# EAGLE design pwrModule (EAGLE 6.5.0)
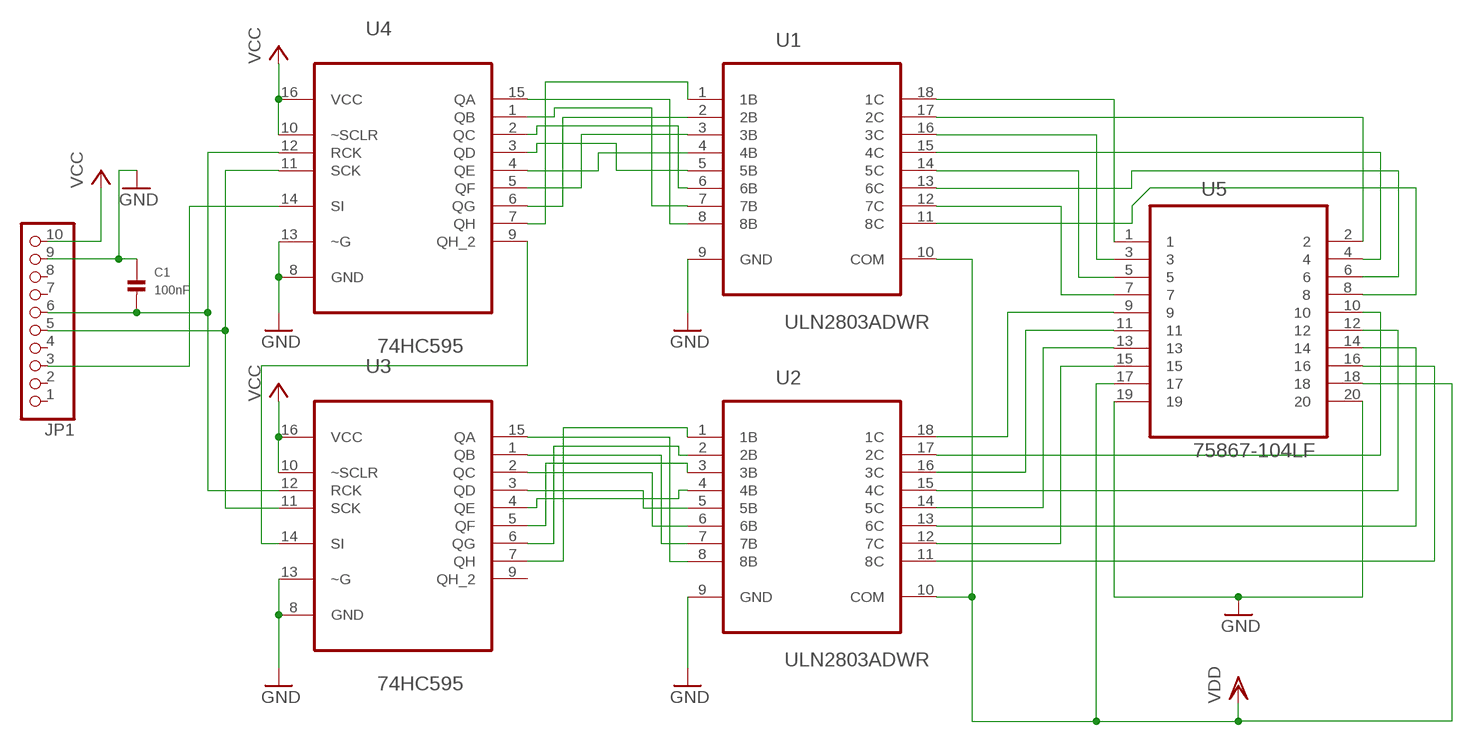
[diagram p0: schematic, sheet 1]

## Parts
C1  100nF  CAP_CERAMIC0805  [0805]
JP1  PINHD-1X10/90  [1X10/90]
U1  ULN2803ADWR  [SOIC127P1030X265-18N]
U2  ULN2803ADWR  [SOIC127P1030X265-18N]
U3  74HC595  M74HC595RM13TR  [SOIC127P600X175-16N]
U4  74HC595  M74HC595RM13TR  [SOIC127P600X175-16N]
U5  75867-104LF  [FCI_75867-104LF]

## Nets
GND: C1.1 JP1.9 U1.9(GND) U2.9(GND) U3.8(GND) U3.13(~G) U4.8(GND) U4.13(~G) U5.19 U5.20
N$1: C1.2 JP1.6 U3.12(RCK) U4.12(RCK)
N$2: JP1.5 U3.11(SCK) U4.11(SCK)
N$3: U3.14(SI) U4.9(QH_2)
N$4: U1.18(1C) U5.1
N$5: U2.8(8B) U3.15(QA)
N$6: U2.7(7B) U3.1(QB)
N$7: U2.6(6B) U3.2(QC)
N$8: U2.5(5B) U3.3(QD)
N$9: U2.4(4B) U3.4(QE)
N$10: U2.3(3B) U3.5(QF)
N$11: U2.2(2B) U3.6(QG)
N$12: U2.1(1B) U3.7(QH)
N$13: U1.1(1B) U4.7(QH)
N$14: U1.2(2B) U4.6(QG)
N$15: U1.3(3B) U4.5(QF)
N$16: U1.4(4B) U4.4(QE)
N$17: U1.5(5B) U4.3(QD)
N$18: U1.8(8B) U4.15(QA)
N$19: U1.7(7B) U4.1(QB)
N$20: U1.6(6B) U4.2(QC)
N$21: JP1.3 U4.14(SI)
N$22: U1.17(2C) U5.2
N$23: U1.16(3C) U5.3
N$24: U1.15(4C) U5.4
N$25: U1.14(5C) U5.5
N$26: U1.13(6C) U5.6
N$27: U1.12(7C) U5.7
N$28: U1.11(8C) U5.8
N$29: U2.18(1C) U5.9
N$30: U2.17(2C) U5.10
N$31: U2.16(3C) U5.11
N$32: U2.15(4C) U5.12
N$33: U2.14(5C) U5.13
N$34: U2.13(6C) U5.14
N$35: U2.12(7C) U5.15
N$36: U2.11(8C) U5.16
VCC: JP1.10 U3.10(~SCLR) U3.16(VCC) U4.10(~SCLR) U4.16(VCC)
VDD: U1.10(COM) U2.10(COM) U5.17 U5.18
Unconnected: JP1.1 JP1.2 JP1.4 JP1.7 JP1.8 U3.9(QH_2)

## Library data of the parts
C1 = microbuilder:CAP_CERAMIC: Ceramic Capacitors 0402 - 0402 Surface Mount Capacitors 16pF 50V 5% [Digikey: 445-4899-2-ND] 18pF 50V 5% [Digikey: 490-1281-2-ND] 22pF 50V 5% [Digikey: 490-1283-2-ND] 68pF 50V 5% [Digikey: 490-1289-2-ND] 0.1uF 10V 10% [Digikey: 490-1318-2-ND] 1.0uF 6.3V 10% [Digikey: 490-1320-2-ND] 0603 - 0603 Surface Mount Capacitors 16 pF 50V 5% [Digikey: 445-5051-2-ND] 22 pF 50V [Digikey: PCC220ACVTR-ND] 33 pF 50V 5% [Digikey: 490-1415-1-ND] 56pF 50V 5% [Digikey: 490-1421-1-ND] 220pF 50V 5% [Digikey: 445-1285-1-ND] 680 pF 50V 2200 pF 50V 5% C0G [Digikey: 445-1297-1-ND] 5600 pF 100V 5% X7R [Digikey: 478-3711-1-ND] 0.1 µF 25V 10% [Digikey: PCC2277TR-ND] 0.22 µF 16V 10% X7R [Digikey: 445-1318-1-ND] 1.0 µF 25V 10% [Digikey: 445-5146-2-ND] 0603 - RF Specific 3pF 250V +/-0.1pF RF [Digikey: 712-1347-1-ND] 18 pF 250V 5% [Digikey: 478-3505-1-ND or 712-1322-1-ND] 56 pF 250V 5% C0G RF [Digikey: 490-4867-1-ND] 68 pF 250V RF [Digikey: 490-4868-1-ND] 0805 - 0805 Surface Mount Capacitors 220 pF 250V 2% RF Ceramic Capacitor [Digikey: 712-1398-1-ND] 1000 pF 50V 2% NP0 Ceramic Capacitor [Digikey: 478-3760-1-ND] 0.1 µF 25V 10% Ceramic Capacitor [Digikey: PCC1828TR-ND] 1.0 µF 16V 10% Ceramic Capacitor[Digikey: 490-1691-2-ND] 10.0 µF 10V 10% Ceramic Capacitor[Digikey: 709-1228-1-ND] 10.0 uF 16V 10% Ceramic Capacitor [Digikey: 478-5165-2-ND] 47 uF 6.3V 20% Ceramic Capacitor [Digikey: 587-1779-1-ND or 399-5506-1-ND] 1206 - 1206 Surface Mount Capacitors 47uF 10V 20% Ceramic Capacitor [Digikey: 490-5528-1-ND or 399-5508-1-ND or 445-6010-1-ND] 100uF 6.3V -20%, +80% Y5V Ceramic Capacitor (Digikey: 490-4512-1-ND, Mouser: 81-GRM31CF50J107ZE1L)
JP1 = pinhead:PINHD-1X10: PIN HEADER
U1 U2 = uln2803:ULN2803ADWR: Darlington transistor array; MPN: ULN2803ADWR; OC_FARNELL: 1652420; OC_NEWARK: 87H4769; PACKAGE: SOIC-18; SUPPLIER: TEXAS INSTRUMENTS
U3 U4 = 74HC595:M74HC595RM13TR: 8 BIT SHIFT REGISTER WITH OUTPUT LATCHES (3 STATE); MPN: M74HC595RM13TR; OC_FARNELL: 1288450; OC_NEWARK: 89K0930; PACKAGE: SOIC-16; SUPPLIER: STMICROELECTRONICS
U5 = HE10-20:75867-104LF: HEADER, RIGHT ANGLE-20POS; MPN: 75867-104LF; OC_FARNELL: 1103958; OC_NEWARK: 93K5084; PACKAGE: CONN-20POS; SUPPLIER: FCI

## Board
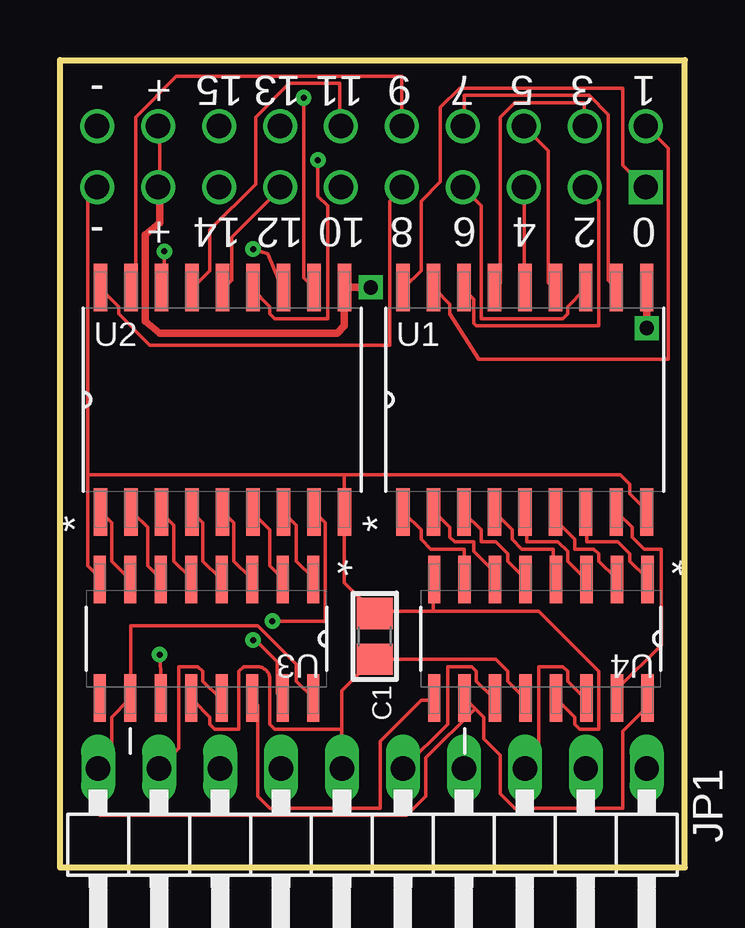
[diagram p1: board, top side]
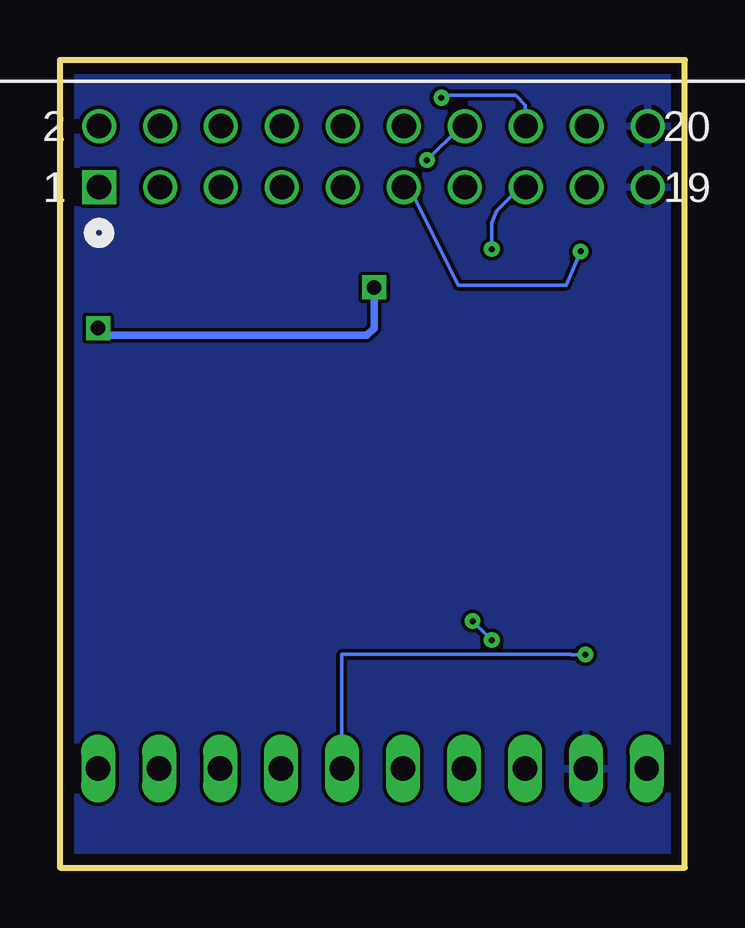
[diagram p2: board, bottom side, seen from below]

Size 26.04 x 33.66 mm. Coordinates in mm from the lower left corner, seen from the top.
Outline: 0,0 0,33.66 26.04,33.66 26.04,0 0,0
Copper layers (1*16): Top 0.018mm / dielectric 1.55mm / Bottom 0.018mm
Design rules "eC-STANDARD_pool-2-layer ": minimum track width 0.15mm, minimum drill 0.25mm, track to track 0.15mm, track to pad 0.15mm, pad to pad 0.15mm, via to via 0.15mm, smd to smd 0.15mm, copper to edge 0.45mm, drill to drill 0.3mm, minimum pad ring 0.2mm, minimum via ring 0.2mm, stop-mask expansion 0.1mm, vias tented up to drill 0mil, thermal gap 0.2mm

### Footprints (pad centres in the part's own frame; a part is rotated, then mirrored left to right if it is on the bottom)
0805 = smd 1.3 x 1.5: 1 -0.95,0; 2 0.95,0
1X10/90 = drill 1.016 long: 1 -11.43,-3.81; 2 -8.89,-3.81; 3 -6.35,-3.81; 4 -3.81,-3.81; 5 -1.27,-3.81; 6 1.27,-3.81; 7 3.81,-3.81; 8 6.35,-3.81; 9 8.89,-3.81; 10 11.43,-3.81
SOIC127P1030X265-18N = smd 1.981 x 0.559: 1 -4.674,5.08; 2 -4.674,3.81; 3 -4.674,2.54; 4 -4.674,1.27; 5 -4.674,0; 6 -4.674,-1.27; 7 -4.674,-2.54; 8 -4.674,-3.81; 9 -4.674,-5.08; 10 4.674,-5.08; 11 4.674,-3.81; 12 4.674,-2.54; 13 4.674,-1.27; 14 4.674,0; 15 4.674,1.27; 16 4.674,2.54; 17 4.674,3.81; 18 4.674,5.08
SOIC127P600X175-16N = smd 1.981 x 0.508: 1 -2.464,4.445; 2 -2.464,3.175; 3 -2.464,1.905; 4 -2.464,0.635; 5 -2.464,-0.635; 6 -2.464,-1.905; 7 -2.464,-3.175; 8 -2.464,-4.445; 9 2.464,-4.445; 10 2.464,-3.175; 11 2.464,-1.905; 12 2.464,-0.635; 13 2.464,0.635; 14 2.464,1.905; 15 2.464,3.175; 16 2.464,4.445
FCI_75867-104LF = drill 1.016 square: 1 -22.86,-2.54 | drill 1.016: 2 -22.86,0; 3 -20.32,-2.54; 4 -20.32,0; 5 -17.78,-2.54; 6 -17.78,0; 7 -15.24,-2.54; 8 -15.24,0; 9 -12.7,-2.54; 10 -12.7,0; 11 -10.16,-2.54; 12 -10.16,0; 13 -7.62,-2.54; 14 -7.62,0; 15 -5.08,-2.54; 16 -5.08,0; 17 -2.54,-2.54; 18 -2.54,0; 19 0,-2.54; 20 0,0

### Placement (x,y rotation side)
C1  13.12,9.64 270 top
JP1  13.02,0.32 180 top
U1  19.37,19.5 90 top
U2  6.77,19.5 90 top
U3  6.1,9.54 270 top
U4  20.03,9.54 270 top
U5  1.55,30.9 0 bottom

### Tracks (layer width: path | path; a pad name or v marks a point on that pad's centre or on a via)
GND
  Top 0.15: 15.55,10.68 13.15,10.68 C1.1 13.05,10.68 11.85,11.88 U2.9 11.85,16.38 | 15.55,10.68 15.55,11.98 U4.8 | 15.55,10.68 19.95,10.68 22.45,8.18 22.45,5.78 21.65,5.78 21.45,5.98 21.45,6.28 20.75,6.98 U4.13 | 11.85,16.38 23.35,16.38 23.75,15.98 23.75,15.58 24.45,14.88 U1.9 | 1.15,16.38 1.15,27.88 1.55,28.28 U5.19 | 1.15,16.38 1.15,12.58 1.65,12.08 U3.8 | U3.13 6.65,7.08 5.95,7.78 5.95,8.18 5.75,8.38 4.95,8.38 4.95,4.98 4.15,4.18 JP1.9 | 1.15,16.38 11.85,16.38
  pour Bottom: 0.63,0 0.43,33.25 25.3,33.25 25.4,0
N$1
  Top 0.15: JP1.6 11.75,5.78 | 11.75,5.78 11.75,7.38 13.05,8.68 C1.2 13.15,8.68 18.15,8.68 18.65,8.18 18.65,7.78 19.35,7.08 U4.12 | 11.75,5.78 8.95,5.78 8.75,5.98 8.75,7.84 arc90 8.21,8.38 7.65,8.38 7.45,8.18 7.45,5.78 6.45,5.78 6.25,5.98 6.25,6.28 5.55,6.98 U3.12
N$2  (via drill 0.25)
  Top 0.15: v4.15,8.88 4.25,7.48 4.25,7.08 U3.11 | U4.11 18.05,7.08 17.35,7.78 17.35,8.18 17.15,8.38 16.15,8.38 16.15,5.98 14.35,4.18 JP1.5
  Bottom 0.15: JP1.5 14.29,8.89 4.76,8.89 4.75,8.88 v4.15,8.88
N$3
  Top 0.15: U3.14 8.05,6.98 8.25,6.78 8.25,2.98 8.75,2.48 13.35,2.48 13.35,5.28 15.05,6.98 15.55,6.98 U4.9
N$4
  Top 0.15: U1.18 14.35,24.18 15.05,24.88 15.05,27.78 15.85,28.58 15.85,31.68 16.65,32.48 23.45,32.48 23.45,29.28 24.35,28.38 U5.1
N$5  (via drill 0.25)
  Top 0.15: v8.05,9.48 8.15,9.48 9.05,8.58 9.05,7.28 9.25,7.08 U3.15 | v8.85,10.28 11.05,10.28 11.05,14.38 10.65,14.78 U2.8
  Bottom 0.15: v8.85,10.28 v8.05,9.48
N$6
  Top 0.15: U3.1 10.55,12.08 9.85,12.78 9.85,14.28 9.35,14.78 U2.7
N$7
  Top 0.15: U2.6 8.05,14.78 8.75,14.08 8.75,12.58 9.25,12.08 U3.2
N$8
  Top 0.15: U3.3 7.95,12.08 7.25,12.78 7.25,14.38 6.85,14.78 U2.5
N$9
  Top 0.15: U3.4 6.65,12.08 5.95,12.78 5.95,14.38 5.55,14.78 U2.4
N$10
  Top 0.15: U3.5 5.45,12.08 4.75,12.78 4.75,14.28 4.25,14.78 U2.3
N$11
  Top 0.15: U2.2 3.05,14.78 3.65,14.18 3.65,12.58 4.15,12.08 U3.6
N$12
  Top 0.15: U3.7 2.85,12.08 2.15,12.78 2.15,14.38 1.75,14.78 U2.1
N$13
  Top 0.15: U1.1 14.35,14.78 15.05,14.08 15.05,13.68 15.45,13.28 16.85,13.28 16.85,12.08 U4.7
N$14
  Top 0.15: U1.2 15.65,14.78 16.25,14.18 16.25,13.78 16.45,13.58 17.25,13.58 17.25,13.18 18.05,12.38 18.05,12.08 U4.6
N$15
  Top 0.15: U4.5 19.35,12.08 18.65,12.78 18.65,13.08 18.15,13.58 17.55,13.58 17.55,14.08 16.85,14.78 U1.3
N$16
  Top 0.15: U1.4 18.15,14.78 18.85,14.08 18.85,13.68 19.25,13.28 20.55,13.28 20.55,12.18 20.65,12.08 U4.4
N$17
  Top 0.15: U4.3 21.85,12.08 21.15,12.78 21.15,13.18 20.75,13.58 19.45,13.58 19.45,14.78 U1.5
N$18
  Top 0.15: U1.8 23.25,14.78 23.85,14.18 23.85,13.78 24.35,13.28 25.05,13.28 25.05,9.28 23.25,7.48 23.25,7.08 U4.15
N$19
  Top 0.15: U4.1 24.45,12.08 23.75,12.78 23.75,13.08 23.25,13.58 21.95,13.58 21.95,14.78 U1.7
N$20
  Top 0.15: U4.2 23.15,12.08 22.45,12.78 22.45,13.08 22.25,13.28 21.45,13.28 21.45,13.68 20.65,14.48 20.65,14.78 U1.6
N$21
  Top 0.15: U4.14 21.85,7.08 21.15,7.78 21.15,8.18 20.95,8.38 19.95,8.38 19.95,4.68 19.45,4.18 JP1.3
N$22
  Top 0.15: U1.17 15.65,24.08 16.25,23.48 16.25,23.08 17.45,21.18 25.35,21.18 25.35,29.98 24.45,30.88 U5.2
N$23
  Top 0.15: U1.16 16.85,24.08 17.25,23.68 17.25,22.68 17.35,22.58 22.45,22.58 22.45,27.78 21.95,28.28 U5.3
N$24
  Top 0.15: U1.15 18.15,24.18 18.35,24.38 18.35,31.28 18.95,31.88 21.85,31.88 21.85,30.98 U5.4
N$25
  Top 0.15: U1.14 19.35,24.18 19.35,28.28 U5.5
N$26
  Top 0.15: U1.13 20.55,24.18 20.35,24.38 20.35,29.88 19.35,30.88 U5.6
N$27
  Top 0.15: U1.12 21.85,24.08 21.15,23.38 21.15,23.08 20.95,22.88 17.55,22.88 17.55,27.58 16.85,28.28 U5.7
N$28
  Top 0.15: U1.11 23.15,24.18 22.85,24.48 22.85,31.38 22.05,32.18 16.85,32.18 16.85,30.98 U5.8
N$29
  Top 0.15: U2.18 1.75,24.08 2.45,23.38 2.45,23.08 3.75,21.78 13.75,21.78 13.75,27.78 14.25,28.28 U5.9
N$30
  Top 0.15: U5.10 14.25,32.98 4.85,32.98 3.15,31.28 3.15,24.28 3.05,24.18 U2.17
N$31  (via drill 0.25)
  Top 0.15: v4.35,25.68 4.35,24.28 4.25,24.18 U2.16
  Bottom 0.15: v4.35,25.68 4.95,24.28 9.45,24.28 11.45,28.28 11.65,28.28 U5.11
N$32
  Top 0.15: U2.15 5.55,24.18 6.25,24.88 6.25,26.58 8.15,28.48 8.15,31.28 9.55,32.68 11.65,32.68 11.65,30.98 U5.12
N$33
  Top 0.15: U2.14 6.85,24.18 7.15,24.48 7.15,26.28 9.15,28.28 U5.13
N$34  (via drill 0.25)
  Top 0.15: v10.75,29.48 10.75,27.98 11.15,27.58 11.15,22.88 8.95,22.88 8.75,23.08 8.75,23.38 8.05,24.08 U2.13
  Bottom 0.15: v10.75,29.48 9.35,30.88 9.25,30.88 U5.14
N$35  (via drill 0.25)
  Top 0.15: v8.05,25.78 8.65,25.58 9.25,24.18 U2.12
  Bottom 0.15: v8.05,25.78 8.05,26.88 7.85,27.38 6.95,28.28 6.65,28.28 U5.15
N$36  (via drill 0.25)
  Top 0.15: v10.15,32.08 10.15,24.58 10.55,24.18 U2.11
  Bottom 0.15: v10.15,32.08 10.05,32.18 7.05,32.18 6.65,31.78 6.65,30.98 U5.16
VCC
  Top 0.15: 17.3,6.63 17.65,6.28 17.65,5.38 18.35,4.68 18.35,3.08 18.95,2.48 23.45,2.48 23.45,5.68 24.45,6.68 24.45,6.98 U4.16 24.45,7.08 | 17.3,6.63 16.95,6.98 U4.10 | U3.16 9.85,7.78 9.85,8.48 8.25,10.08 2.95,10.08 2.95,7.08 U3.10 2.85,6.98 2.15,6.28 2.15,4.68 1.65,4.18 JP1.10 1.65,4.08 1.65,2.18 14.45,2.18 15.25,2.98 15.25,4.58 17.3,6.63
VDD  (via drill 0.6)
  Top 0.15: U5.17 4.15,28.38 4.15,30.88 U5.18
  Top 0.305: 4.15,28.38 4.15,26.88 3.55,26.38 3.55,22.78 4.15,22.28 11.55,22.28 11.85,22.58 U2.10 v12.94,24.18 v12.95,24.18 | v24.45,22.48 U1.10
  Bottom 0.305: v12.95,24.18 12.95,22.48 13.25,22.18 24.15,22.18 v24.45,22.48

### Text on the board
tSilk: - | + | 15 | 13 | 11 | 9 | 7 | 5 | 3 | 1 | - | + | 14 | 12 | 10 | 8 | 6 | 4 | 2 | 0